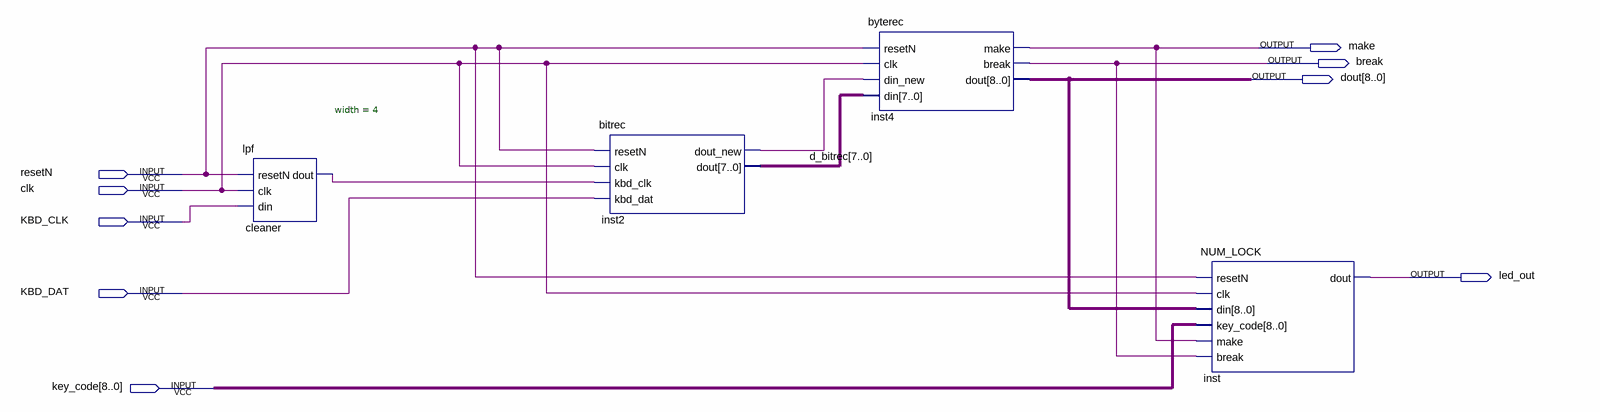
[diagram p0: schematic sheet]
// Quartus schematic test_toggle.bdf as structural Verilog: 4 symbols, 9 pins
module test_toggle (
  input  resetN,
  input  clk,
  input  KBD_CLK,
  input  KBD_DAT,
  input  [8:0] key_code,
  output make,
  output \break ,
  output [8:0] dout,
  output led_out
);

  wire cleaner_dout, inst2_dout_new;
  wire [7:0] d_bitrec;

  lpf #(.width(4)) cleaner (.resetN(resetN), .clk(clk), .din(KBD_CLK), .dout(cleaner_dout));
  bitrec inst2 (
    .resetN(resetN), .clk(clk), .kbd_clk(cleaner_dout), .kbd_dat(KBD_DAT), .dout_new(inst2_dout_new),
    .dout(d_bitrec));
  byterec inst4 (
    .resetN(resetN), .clk(clk), .din_new(inst2_dout_new), .din(d_bitrec), .make(make), .\break (\break ),
    .dout(dout));
  NUM_LOCK inst (
    .resetN(resetN), .clk(clk), .din(dout), .key_code(key_code), .make(make), .\break (\break ),
    .dout(led_out));
endmodule
